# Altium project CSC.PrjPcb
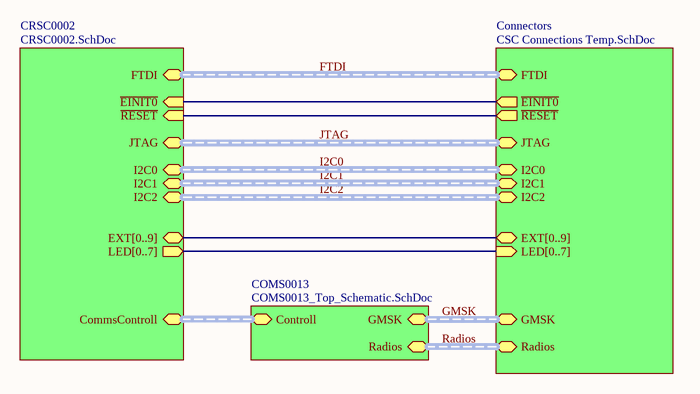
[diagram p0: CRSC0001.SchDoc]
4 sheets, 94 parts. Net scope: hierarchical (ports join the sheet entries above them; power ports are global).
Board file: CSC v2.PcbDoc
Sheets:
  CRSC0001.SchDoc
    CRSC0002 = CRSC0002.SchDoc
    Connectors = CSC Connections Temp.SchDoc
  COMS0004 SwC_Main.SchDoc

## Sheet CRSC0001.SchDoc
size A4

### Sub-sheets
COMS0013 = COMS0013_Top_Schematic.SchDoc (file not in this document): GMSK (harness GMSK), Radios (harness Radios), Controll (harness CommsControll)
Connectors = CSC Connections Temp.SchDoc: JTAG (harness JTAG), FTDI (harness FTDI), I2C0 (harness I2C), I2C1 (harness I2C), I2C2 (harness I2C), GMSK (harness GMSK), Radios (harness Radios), EXT[0..9] (bidir), LED[0..7] (in), ~{EINIT0} (out), ~{RESET} (out)
CRSC0002 = CRSC0002.SchDoc: ~{EINIT0} (in), ~{RESET} (in), I2C1 (harness I2C), I2C0 (harness I2C), I2C2 (harness I2C), JTAG (harness JTAG), CommsControll (harness CommsControll), FTDI (harness FTDI), EXT[0..9] (bidir), LED[0..7] (out)

### Nets
~{RESET}: sheet CRSC0002/~{RESET}, sheet Connectors/~{RESET}
NetS1_3: sheet CRSC0002/~{EINIT0}, sheet Connectors/~{EINIT0}

### Buses and harness runs
bus sheet Connectors/EXT[0..9] = sheet CRSC0002/EXT[0..9]
bus sheet Connectors/LED[0..7] = sheet CRSC0002/LED[0..7]
harness FTDI = sheet Connectors/FTDI = sheet CRSC0002/FTDI
harness GMSK = sheet COMS0013/GMSK = sheet Connectors/GMSK
harness I2C0 = sheet Connectors/I2C0 = sheet CRSC0002/I2C0
harness I2C1 = sheet Connectors/I2C1 = sheet CRSC0002/I2C1
harness I2C2 = sheet Connectors/I2C2 = sheet CRSC0002/I2C2
harness JTAG = sheet Connectors/JTAG = sheet CRSC0002/JTAG
harness Radios = sheet COMS0013/Radios = sheet Connectors/Radios
harness sheet COMS0013/Controll = sheet CRSC0002/CommsControll

## Sheet CRSC0002.SchDoc
size A3; PageSetup: Record=PageOptions|CenterHorizontal=True|CenterVertical=True|PrintScale=0.73|XCorrection=1.00|YCorrection=1.00|PrintKind=1|BorderSize=5000000|LeftOffset=0|BottomOffset=0|Orientation=2|PaperLength=2970|PaperWidth=2100|Scale=100|PaperSource=15|PrintQuality=1200|MediaType=1|DitherType=10|PaperKind=A4|PrintScaleMode=1
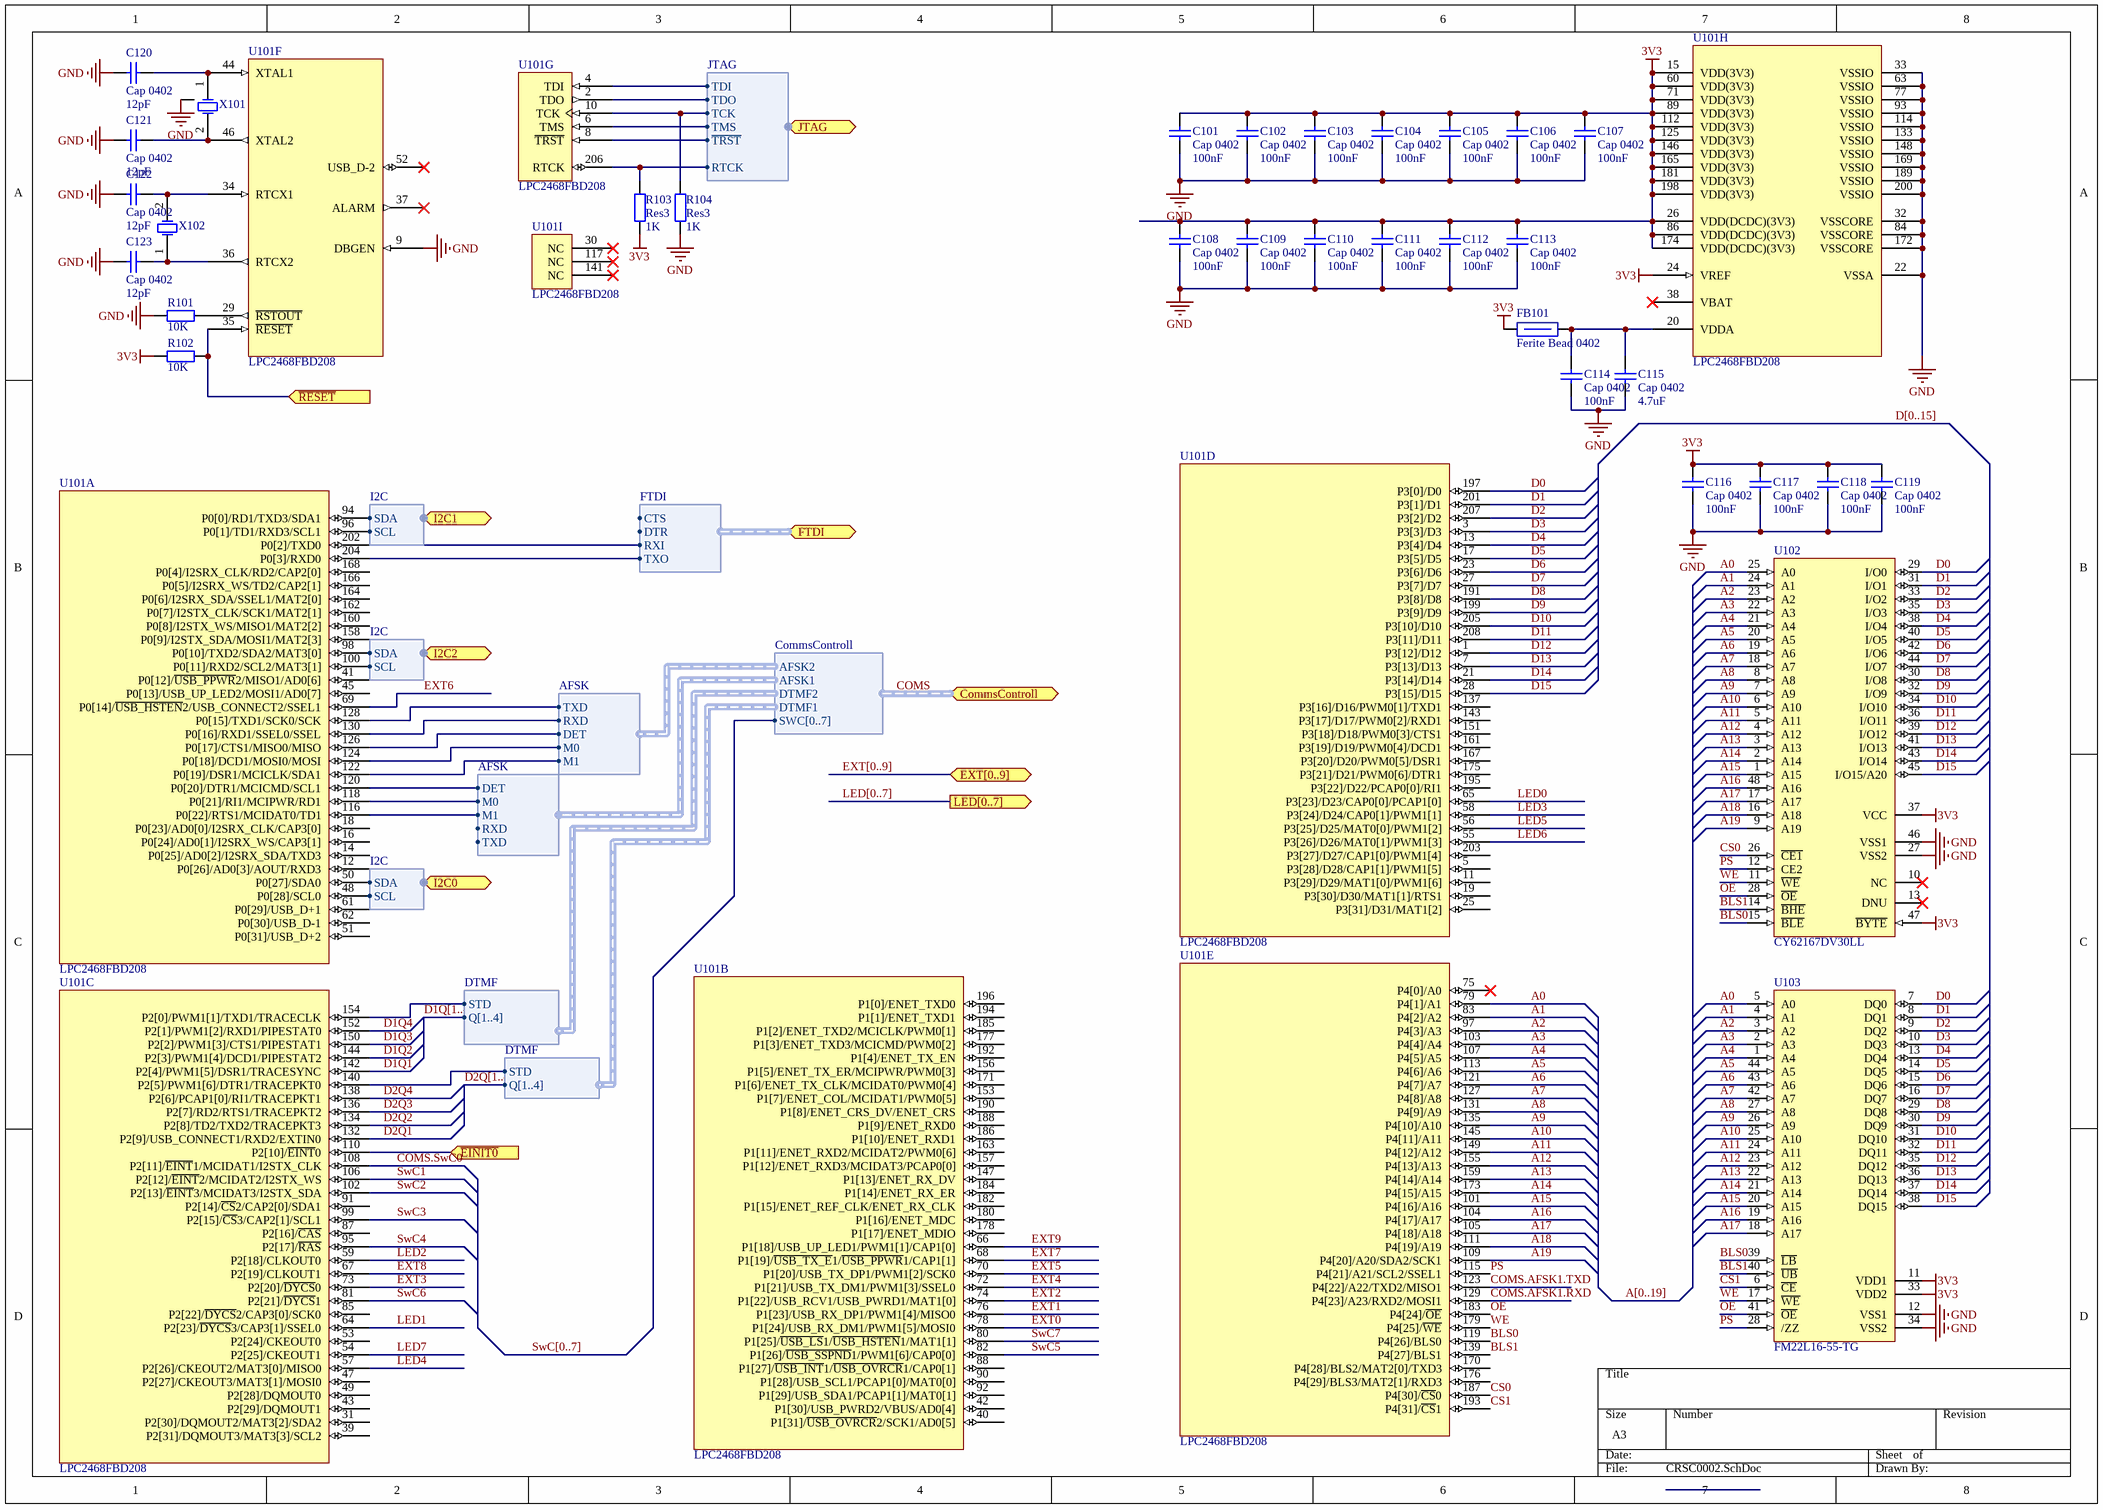
[diagram p1: CRSC0002.SchDoc]

### Parts
C101  Cap 0402  value 100nF  [CAPC1005X06L]
C102  Cap 0402  value 100nF  [CAPC1005X06L]
C103  Cap 0402  value 100nF  [CAPC1005X06L]
C104  Cap 0402  value 100nF  [CAPC1005X06L]
C105  Cap 0402  value 100nF  [CAPC1005X06L]
C106  Cap 0402  value 100nF  [CAPC1005X06L]
C107  Cap 0402  value 100nF  [CAPC1005X06L]
C108  Cap 0402  value 100nF  [CAPC1005X06L]
C109  Cap 0402  value 100nF  [CAPC1005X06L]
C110  Cap 0402  value 100nF  [CAPC1005X06L]
C111  Cap 0402  value 100nF  [CAPC1005X06L]
C112  Cap 0402  value 100nF  [CAPC1005X06L]
C113  Cap 0402  value 100nF  [CAPC1005X06L]
C114  Cap 0402  value 100nF  [CAPC1005X06L]
C115  Cap 0402  value 4.7uF  [CAPC1005X06L]
C116  Cap 0402  value 100nF  [CAPC1005X06L]
C117  Cap 0402  value 100nF  [CAPC1005X06L]
C118  Cap 0402  value 100nF  [CAPC1005X06L]
C119  Cap 0402  value 100nF  [CAPC1005X06L]
C120  Cap 0402  value 12pF  [CAPC1005X06L]
C121  Cap 0402  value 12pF  [CAPC1005X06L]
C122  Cap 0402  value 12pF  [CAPC1005X06L]
C123  Cap 0402  value 12pF  [CAPC1005X06L]
FB101  Ferite Bead 0402  [INDC1005X06L]
R101  value 10K  [RESC1005X06L]  (hidden comment: Res3)
R102  value 10K  [RESC1005X06L]  (hidden comment: Res3)
R103  Res3  value 1K  [RESC1005X06L]
R104  Res3  value 1K  [RESC1005X06L]
U101  LPC2468FBD208  [TSQFP50P3000X3000X160-208L]  (parts A,B,C,D,E,F,G,H,I of 9)
U102  CY62167DV30LL  [TSSOP50P2000X120-48L]
U103  FM22L16-55-TG  [TSOP80P1180X120-44L]
X101  Crystal Oscilator  [7M]  (value not drawn)
X102  Crystal Oscilator  [9H T10]  (value not drawn)

### Ports
CommsControll (harness CommsControll), EXT[0..9] (bidir), FTDI (harness FTDI), I2C0 (harness I2C), I2C1 (harness I2C), I2C2 (harness I2C), JTAG (harness JTAG), LED[0..7] (out), ~{EINIT0} (in), ~{RESET} (in)

### Harnesses
I2C: SDA, SCL
JTAG: TDI, TDO, TCK, TMS, ~{TRST}, RTCK
AFSK: DET, M0, M1, RXD, TXD
DTMF: Q[1..4], STD
CommsControll: AFSK1, AFSK2, DTMF1, DTMF2, SWC[0..7]
FTDI: CTS, DTR, RXI, TXO

### Nets
3V3: C101.2 C102.2 C103.2 C104.2 C105.2 C106.2 C107.2 C108.2 C109.2 C110.2 C111.2 C112.2 C113.2 C116.2 C117.2 C118.2 C119.2 FB101.1 R102.2 R103.2 U101.15(VDD(3V3)) U101.24(VREF) U101.26(VDD(DCDC)(3V3)) U101.60(VDD(3V3)) U101.71(VDD(3V3)) U101.86(VDD(DCDC)(3V3)) U101.89(VDD(3V3)) U101.112(VDD(3V3)) U101.125(VDD(3V3)) U101.146(VDD(3V3)) U101.165(VDD(3V3)) U101.174(VDD(DCDC)(3V3)) U101.181(VDD(3V3)) U101.198(VDD(3V3)) U102.37(VCC) U102.47(~{BYTE}) U103.11(VDD1) U103.33(VDD2)
GND: C101.1 C102.1 C103.1 C104.1 C105.1 C106.1 C107.1 C108.1 C109.1 C110.1 C111.1 C112.1 C113.1 C114.1 C115.1 C116.1 C117.1 C118.1 C119.1 C120.2 C121.1 C122.2 C123.1 R101.2 R104.2 U101.9(DBGEN) U101.22(VSSA) U101.32(VSSCORE) U101.33(VSSIO) U101.63(VSSIO) U101.77(VSSIO) U101.84(VSSCORE) U101.93(VSSIO) U101.114(VSSIO) U101.133(VSSIO) U101.148(VSSIO) U101.169(VSSIO) U101.172(VSSCORE) U101.189(VSSIO) U101.200(VSSIO) U102.27(VSS2) U102.46(VSS1) U103.12(VSS1) U103.34(VSS2) X101.3
A0: U101.79(P4[1]/A1) U102.25(A0) U103.5(A0)
A1: U101.83(P4[2]/A2) U102.24(A1) U103.4(A1)
A2: U101.97(P4[3]/A3) U102.23(A2) U103.3(A2)
A3: U101.103(P4[4]/A4) U102.22(A3) U103.2(A3)
A4: U101.107(P4[5]/A5) U102.21(A4) U103.1(A4)
A5: U101.113(P4[6]/A6) U102.20(A5) U103.44(A5)
A6: U101.121(P4[7]/A7) U102.19(A6) U103.43(A6)
A7: U101.127(P4[8]/A8) U102.18(A7) U103.42(A7)
A8: U101.131(P4[9]/A9) U102.8(A8) U103.27(A8)
A9: U101.135(P4[10]/A10) U102.7(A9) U103.26(A9)
A10: U101.145(P4[11]/A11) U102.6(A10) U103.25(A10)
A11: U101.149(P4[12]/A12) U102.5(A11) U103.24(A11)
A12: U101.155(P4[13]/A13) U102.4(A12) U103.23(A12)
A13: U101.159(P4[14]/A14) U102.3(A13) U103.22(A13)
A14: U101.173(P4[15]/A15) U102.2(A14) U103.21(A14)
A15: U101.101(P4[16]/A16) U102.1(A15) U103.20(A15)
A16: U101.104(P4[17]/A17) U102.48(A16) U103.19(A16)
A17: U101.105(P4[18]/A18) U102.17(A17) U103.18(A17)
A18: U101.111(P4[19]/A19) U102.16(A18)
A19: U101.109(P4[20]/A20/SDA2/SCK1) U102.9(A19)
BLS0: U101.119(P4[26]/BLS0) U102.15(~{BLE}) U103.39(~{LB})
BLS1: U101.139(P4[27]/BLS1) U102.14(~{BHE}) U103.40(~{UB})
COMS.AFSK1.RXD: U101.129(P4[23]/A23/RXD2/MOSI1)
COMS.AFSK1.TXD: U101.123(P4[22]/A22/TXD2/MISO1)
COMS.SwC0: U101.108(P2[11]/~{EINT}1/MCIDAT1/I2STX_CLK)
CS0: U101.187(P4[30]/~{CS}0) U102.26(~{CE1})
CS1: U101.193(P4[31]/~{CS}1) U103.6(~{CE})
D0: U101.197(P3[0]/D0) U102.29(I/O0) U103.7(DQ0)
D1: U101.201(P3[1]/D1) U102.31(I/O1) U103.8(DQ1)
D1Q1: U101.142(P2[4]/PWM1[5]/DSR1/TRACESYNC)
D1Q2: U101.144(P2[3]/PWM1[4]/DCD1/PIPESTAT2)
D1Q3: U101.150(P2[2]/PWM1[3]/CTS1/PIPESTAT1)
D1Q4: U101.152(P2[1]/PWM1[2]/RXD1/PIPESTAT0)
D2: U101.207(P3[2]/D2) U102.33(I/O2) U103.9(DQ2)
D2Q1: U101.132(P2[9]/USB_CONNECT1/RXD2/EXTIN0)
D2Q2: U101.134(P2[8]/TD2/TXD2/TRACEPKT3)
D2Q3: U101.136(P2[7]/RD2/RTS1/TRACEPKT2)
D2Q4: U101.138(P2[6]/PCAP1[0]/RI1/TRACEPKT1)
D3: U101.3(P3[3]/D3) U102.35(I/O3) U103.10(DQ3)
D4: U101.13(P3[4]/D4) U102.38(I/O4) U103.13(DQ4)
D5: U101.17(P3[5]/D5) U102.40(I/O5) U103.14(DQ5)
D6: U101.23(P3[6]/D6) U102.42(I/O6) U103.15(DQ6)
D7: U101.27(P3[7]/D7) U102.44(I/O7) U103.16(DQ7)
D8: U101.191(P3[8]/D8) U102.30(I/O8) U103.29(DQ8)
D9: U101.199(P3[9]/D9) U102.32(I/O9) U103.30(DQ9)
D10: U101.205(P3[10]/D10) U102.34(I/O10) U103.31(DQ10)
D11: U101.208(P3[11]/D11) U102.36(I/O11) U103.32(DQ11)
D12: U101.1(P3[12]/D12) U102.39(I/O12) U103.35(DQ12)
D13: U101.7(P3[13]/D13) U102.41(I/O13) U103.36(DQ13)
D14: U101.21(P3[14]/D14) U102.43(I/O14) U103.37(DQ14)
D15: U101.28(P3[15]/D15) U102.45(I/O15/A20) U103.38(DQ15)
EXT0: U101.78(P1[24]/USB_RX_DM1/PWM1[5]/MOSI0)
EXT1: U101.76(P1[23]/USB_RX_DP1/PWM1[4]/MISO0)
EXT2: U101.74(P1[22]/USB_RCV1/USB_PWRD1/MAT1[0])
EXT3: U101.73(P2[20]/~{DYCS}0)
EXT4: U101.72(P1[21]/USB_TX_DM1/PWM1[3]/SSEL0)
EXT5: U101.70(P1[20]/USB_TX_DP1/PWM1[2]/SCK0)
EXT6: U101.69(P0[14]/~{USB_HSTEN}2/USB_CONNECT2/SSEL1)
EXT7: U101.68(P1[19]/~{USB_TX_E}1/~{USB_PPWR}1/CAP1[1])
EXT8: U101.67(P2[19]/CLKOUT1)
EXT9: U101.66(P1[18]/USB_UP_LED1/PWM1[1]/CAP1[0])
FTDI.RXI: U101.202(P0[2]/TXD0) ; port FTDI.RXI
FTDI.TXO: U101.204(P0[3]/RXD0) ; port FTDI.TXO
I2C0.SCL: U101.48(P0[28]/SCL0) ; port I2C0.SCL
I2C0.SDA: U101.50(P0[27]/SDA0) ; port I2C0.SDA
I2C1.SCL: U101.96(P0[1]/TD1/RXD3/SCL1) ; port I2C1.SCL
I2C1.SDA: U101.94(P0[0]/RD1/TXD3/SDA1) ; port I2C1.SDA
I2C2.SCL: U101.100(P0[11]/RXD2/SCL2/MAT3[1]) ; port I2C2.SCL
I2C2.SDA: U101.98(P0[10]/TXD2/SDA2/MAT3[0]) ; port I2C2.SDA
JTAG.RTCK: R103.1 U101.206(RTCK) ; port JTAG.RTCK
JTAG.~{TRST}: U101.8(~{TRST}) ; port JTAG.~{TRST}
JTAG.TCK: R104.1 U101.10(TCK) ; port JTAG.TCK
JTAG.TDI: U101.4(TDI) ; port JTAG.TDI
JTAG.TDO: U101.2(TDO) ; port JTAG.TDO
JTAG.TMS: U101.6(TMS) ; port JTAG.TMS
LED0: U101.65(P3[23]/D23/CAP0[0]/PCAP1[0])
LED1: U101.64(P2[23]/~{DYCS}3/CAP3[1]/SSEL0)
LED2: U101.59(P2[18]/CLKOUT0)
LED3: U101.58(P3[24]/D24/CAP0[1]/PWM1[1])
LED4: U101.57(P2[26]/CKEOUT2/MAT3[0]/MISO0)
LED5: U101.56(P3[25]/D25/MAT0[0]/PWM1[2])
LED6: U101.55(P3[26]/D26/MAT0[1]/PWM1[3])
LED7: U101.54(P2[25]/CKEOUT1)
OE: U101.183(P4[24]/~{OE}) U102.28(~{OE}) U103.41(~{OE})
PS: U101.115(P4[21]/A21/SCL2/SSEL1) U102.12(CE2) U103.28(/ZZ)
~{RESET}: R102.1 U101.35(~{RESET}) ; port ~{RESET}
SwC1: U101.106(P2[12]/~{EINT}2/MCIDAT2/I2STX_WS)
SwC2: U101.102(P2[13]/~{EINT}3/MCIDAT3/I2STX_SDA)
SwC3: U101.99(P2[15]/~{CS}3/CAP2[1]/SCL1)
SwC4: U101.95(P2[17]/~{RAS})
SwC5: U101.82(P1[26]/~{USB_SSPND}1/PWM1[6]/CAP0[0])
SwC6: U101.81(P2[21]/~{DYCS}1)
SwC7: U101.80(P1[25]/~{USB_LS}1/~{USB_HSTEN}1/MAT1[1])
WE: U101.179(P4[25]/~{WE}) U102.11(~{WE}) U103.17(~{WE})
NetC114_2: C114.2 C115.2 FB101.2 U101.20(VDDA)
NetC120_1: C120.1 U101.44(XTAL1) X101.1(OSC1)
NetC121_2: C121.2 U101.46(XTAL2) X101.2(OSC2)
NetC122_1: C122.1 U101.34(RTCX1) X102.2(OSC2)
NetC123_2: C123.2 U101.36(RTCX2) X102.1(OSC1)
NetR101_1: R101.1 U101.29(~{RSTOUT})
NetS1_3: U101.110(P2[10]/~{EINT}0) ; port ~{EINIT0}
NetU101_116: U101.116(P0[22]/RTS1/MCIDAT0/TD1) ; harness AFSK.M1
NetU101_118: U101.118(P0[21]/RI1/MCIPWR/RD1) ; harness AFSK.M0
NetU101_120: U101.120(P0[20]/DTR1/MCICMD/SCL1) ; harness AFSK.DET
NetU101_122: U101.122(P0[19]/DSR1/MCICLK/SDA1) ; harness AFSK.M1
NetU101_124: U101.124(P0[18]/DCD1/MOSI0/MOSI) ; harness AFSK.M0
NetU101_126: U101.126(P0[17]/CTS1/MISO0/MISO) ; harness AFSK.DET
NetU101_128: U101.128(P0[15]/TXD1/SCK0/SCK) ; harness AFSK.TXD
NetU101_130: U101.130(P0[16]/RXD1/SSEL0/SSEL) ; harness AFSK.RXD
NetU101_140: U101.140(P2[5]/PWM1[6]/DTR1/TRACEPKT0) ; harness DTMF.STD
NetU101_154: U101.154(P2[0]/PWM1[1]/TXD1/TRACECLK) ; harness DTMF.STD

Not connected (* = marked no-connect by the designer): U101 5(P3[28]/D28/CAP1[1]/PWM1[5]) 11(P3[29]/D29/MAT1[0]/PWM1[6]) 12(P0[26]/AD0[3]/AOUT/RXD3) 14(P0[25]/AD0[2]/I2SRX_SDA/TXD3) 16(P0[24]/AD0[1]/I2SRX_WS/CAP3[1]) 18(P0[23]/AD0[0]/I2SRX_CLK/CAP3[0]) 19(P3[30]/D30/MAT1[1]/RTS1) 25(P3[31]/D31/MAT1[2]) 30(NC)* 31(P2[30]/DQMOUT2/MAT3[2]/SDA2) 37(ALARM)* 38(VBAT)* 39(P2[31]/DQMOUT3/MAT3[3]/SCL2) 40(P1[31]/~{USB_OVRCR}2/SCK1/AD0[5]) 41(P0[12]/~{USB_PPWR}2/MISO1/AD0[6]) 42(P1[30]/USB_PWRD2/VBUS/AD0[4]) 43(P2[29]/DQMOUT1) 45(P0[13]/USB_UP_LED2/MOSI1/AD0[7]) 47(P2[27]/CKEOUT3/MAT3[1]/MOSI0) 49(P2[28]/DQMOUT0) 51(P0[31]/USB_D+2) 52(USB_D-2)* 53(P2[24]/CKEOUT0) 61(P0[29]/USB_D+1) 62(P0[30]/USB_D-1) 75(P4[0]/A0)* 85(P2[22]/~{DYCS}2/CAP3[0]/SCK0) 87(P2[16]/~{CAS}) 88(P1[27]/~{USB_INT}1/~{USB_OVRCR}1/CAP0[1]) 90(P1[28]/USB_SCL1/PCAP1[0]/MAT0[0]) 91(P2[14]/~{CS}2/CAP2[0]/SDA1) 92(P1[29]/USB_SDA1/PCAP1[1]/MAT0[1]) 117(NC)* 137(P3[16]/D16/PWM0[1]/TXD1) 141(NC)* 143(P3[17]/D17/PWM0[2]/RXD1) 147(P1[13]/ENET_RX_DV) 151(P3[18]/D18/PWM0[3]/CTS1) 153(P1[7]/ENET_COL/MCIDAT1/PWM0[5]) 156(P1[5]/ENET_TX_ER/MCIPWR/PWM0[3]) 157(P1[12]/ENET_RXD3/MCIDAT3/PCAP0[0]) 158(P0[9]/I2STX_SDA/MOSI1/MAT2[3]) 160(P0[8]/I2STX_WS/MISO1/MAT2[2]) 161(P3[19]/D19/PWM0[4]/DCD1) 162(P0[7]/I2STX_CLK/SCK1/MAT2[1]) 163(P1[11]/ENET_RXD2/MCIDAT2/PWM0[6]) 164(P0[6]/I2SRX_SDA/SSEL1/MAT2[0]) 166(P0[5]/I2SRX_WS/TD2/CAP2[1]) 167(P3[20]/D20/PWM0[5]/DSR1) 168(P0[4]/I2SRX_CLK/RD2/CAP2[0]) 170(P4[28]/BLS2/MAT2[0]/TXD3) 171(P1[6]/ENET_TX_CLK/MCIDAT0/PWM0[4]) 175(P3[21]/D21/PWM0[6]/DTR1) 176(P4[29]/BLS3/MAT2[1]/RXD3) 177(P1[3]/ENET_TXD3/MCICMD/PWM0[2]) 178(P1[17]/ENET_MDIO) 180(P1[16]/ENET_MDC) 182(P1[15]/ENET_REF_CLK/ENET_RX_CLK) 184(P1[14]/ENET_RX_ER) 185(P1[2]/ENET_TXD2/MCICLK/PWM0[1]) 186(P1[10]/ENET_RXD1) 188(P1[9]/ENET_RXD0) 190(P1[8]/ENET_CRS_DV/ENET_CRS) 192(P1[4]/ENET_TX_EN) 194(P1[1]/ENET_TXD1) 195(P3[22]/D22/PCAP0[0]/RI1) 196(P1[0]/ENET_TXD0) 203(P3[27]/D27/CAP1[0]/PWM1[4]); U102 10(NC)* 13(DNU)*

### Buses and harness runs
bus A[0..19]
bus D1Q[1..4]
bus D2Q[1..4]
bus D[0..15]
bus EXT[0..9] = port EXT[0..9]
bus LED[0..7] = port LED[0..7]
bus SwC[0..7]
harness COMS = port CommsControll

### Library data of the parts
C101-C123 = Cap 0402: Capacitor; Published: 8-Jun-2000; LatestRevisionDate: 17-Jul-2002; LatestRevisionNote: Re-released for DXP Platform.; PackageReference: RAD-0.3; Publisher: Altium Limited; PackageDescription: Radial Cap, Thru-Hole; 2 Leads; 0.3 in Pin Spacing
FB101 = FB_0402: Ferite Bead : 0402; Published: 8-Jun-2000; LatestRevisionDate: 29-May-2009; LatestRevisionNote: IPC-7351 Footprint Added.; PackageReference: J1-0603; Publisher: Altium Limited; PackageDescription: Chip Resistor
R101-R104 = Res3: Resistor; Published: 8-Jun-2000; LatestRevisionDate: 29-May-2009; LatestRevisionNote: IPC-7351 Footprint Added.; PackageReference: J1-0603; Publisher: Altium Limited; PackageDescription: Chip Resistor
U101 = LPC2468FBD208: ARM7 16/32-Bit Microcontroller, 512KB Flash, 98KB RAM, 208-Lead LQFP; Code_IEC: 136E30; Published: 17-Aug-2007; DatasheetVersion: rev.01, Jul-2007; PackageVersion: Feb-2003; PackageReference: SOT459-1; Publisher: Altium Limited; PackageDescription: 208-Pin Plastic Low Profile Quad Flat Pack, LQFP208; Code_JEDEC: MS-026; ComponentLink1Description: Manufacturer Link; ComponentLink1URL: http://www.nxp.com/; ComponentLink2Description: Datasheet; ComponentLink2URL: http://www.standardics.nxp.com/products/lpc2000/datasheet/lpc2468.pdf
U102 = CY62167DV30LL: 16-Mbit (1M x 16) Static RAM; ColumnAddress: A0-A9; Publisher: Altium Limited; ComponentLink1Description: Manufacturer Link; ComponentLink2Description: Datasheet
U103 = FM22L16-55-TG: FRAM, 2MB, 3V, 60NS, 44TSOP2; ColumnAddress: A0-A9; LatestRevisionDate: 13-Apr-2006; DatasheetVersion: rev1.1, Feb-2004; PackageReference: TSOP2-44_M; PackageDescription: 44-Pin Small Outline Package 0.8 mm Pitch; ComponentLink1Description: Manufacturer Link; ComponentLink2Description: Datasheet
X101 = C.O. 4pins: Crystal Oscillator; Value: 12.000MHz; Published: 8-Jun-2000; LatestRevisionDate: 17-Jul-2002; LatestRevisionNote: Re-released for DXP Platform.; PackageReference: R38; Publisher: Altium Limited
X102 = C.O. 2pins: Crystal Oscillator; Value: 12.000MHz; Published: 8-Jun-2000; LatestRevisionDate: 17-Jul-2002; LatestRevisionNote: Re-released for DXP Platform.; PackageReference: R38; Publisher: Altium Limited

## Sheet CSC Connections Temp.SchDoc
size A4
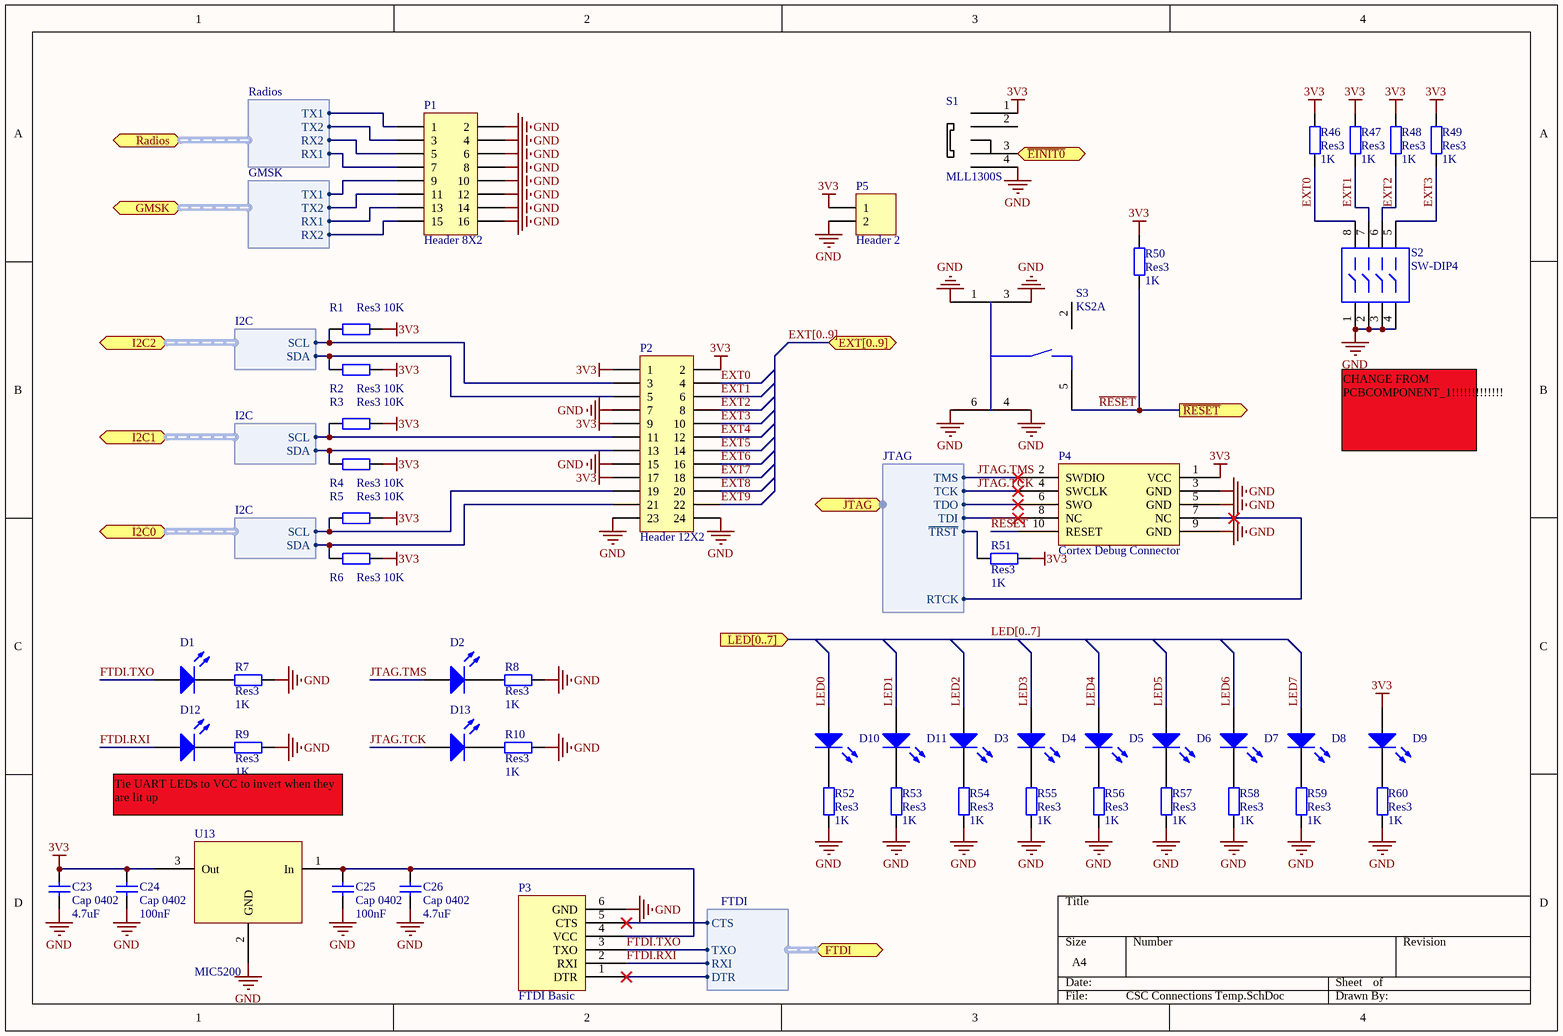
[diagram p2: CSC Connections Temp.SchDoc]

### Parts
C23  Cap 0402  value 4.7uF  [CAPC1005X06L]
C24  Cap 0402  value 100nF  [CAPC1005X06L]
C25  Cap 0402  value 100nF  [CAPC1005X06L]
C26  Cap 0402  value 4.7uF  [CAPC1005X06L]
D1  LED - ASMT-Rx45  [ASMT-Rx45]  (value not drawn)
D2  LED - ASMT-Rx45  [ASMT-Rx45]  (value not drawn)
D3  LED - ASMT-Rx45  [ASMT-Rx45]  (value not drawn)
D4  LED - ASMT-Rx45  [ASMT-Rx45]  (value not drawn)
D5  LED - ASMT-Rx45  [ASMT-Rx45]  (value not drawn)
D6  LED - ASMT-Rx45  [ASMT-Rx45]  (value not drawn)
D7  LED - ASMT-Rx45  [ASMT-Rx45]  (value not drawn)
D8  LED - ASMT-Rx45  [ASMT-Rx45]  (value not drawn)
D9  LED - ASMT-Rx45  [ASMT-Rx45]  (value not drawn)
D10  LED - ASMT-Rx45  [ASMT-Rx45]  (value not drawn)
D11  LED - ASMT-Rx45  [ASMT-Rx45]  (value not drawn)
D12  LED - ASMT-Rx45  [ASMT-Rx45]  (value not drawn)
D13  LED - ASMT-Rx45  [ASMT-Rx45]  (value not drawn)
P1  Header 8X2  [HDR2X8]
P2  Header 12X2  [HDR2X12]
P3  FTDI Basic  [FTDI BASIC]
P4  Cortex Debug Connector  [FTSH-105-01-L-DV-TR]
P5  Header 2  [HDR1X2]
R1  Res3  value 10K  [RESC1005X06L]
R2  Res3  value 10K  [RESC1005X06L]
R3  Res3  value 10K  [RESC1005X06L]
R4  Res3  value 10K  [RESC1005X06L]
R5  Res3  value 10K  [RESC1005X06L]
R6  Res3  value 10K  [RESC1005X06L]
R7  Res3  value 1K  [RESC1005X06L]
R8  Res3  value 1K  [RESC1005X06L]
R9  Res3  value 1K  [RESC1005X06L]
R10  Res3  value 1K  [RESC1005X06L]
R46  Res3  value 1K  [RESC1005X06L]
R47  Res3  value 1K  [RESC1005X06L]
R48  Res3  value 1K  [RESC1005X06L]
R49  Res3  value 1K  [RESC1005X06L]
R50  Res3  value 1K  [RESC1005X06L]
R51  Res3  value 1K  [RESC1005X06L]
R52  Res3  value 1K  [RESC1005X06L]
R53  Res3  value 1K  [RESC1005X06L]
R54  Res3  value 1K  [RESC1005X06L]
R55  Res3  value 1K  [RESC1005X06L]
R56  Res3  value 1K  [RESC1005X06L]
R57  Res3  value 1K  [RESC1005X06L]
R58  Res3  value 1K  [RESC1005X06L]
R59  Res3  value 1K  [RESC1005X06L]
R60  Res3  value 1K  [RESC1005X06L]
S1  MLL1300S  [MILL1300S]
S2  SW-DIP4  [PCBComponent_1]
S3  KS2A  [K5A2]
U13  MIC5200  [SOT230P710X170-4L]

### Ports
EXT[0..9] (bidir), FTDI (harness FTDI), GMSK (harness GMSK), I2C0 (harness I2C), I2C1 (harness I2C), I2C2 (harness I2C), JTAG (harness JTAG), LED[0..7] (in), Radios (harness Radios), ~{EINIT0} (out), ~{RESET} (out)

### Harnesses
JTAG: RTCK, ~{TRST}, TCK, TDI, TDO, TMS
FTDI: DTR, RXI, TXO, CTS
I2C: SCL, SDA
GMSK: RX1, RX2, TX1, TX2
Radios: RX1, RX2, TX1, TX2

### Nets
3V3: C23.2 C24.2 D9.1(A) P2.1 P2.2 P2.9 P2.17 P4.1(VCC) P5.1 R1.2 R2.2 R3.2 R4.2 R5.2 R6.2 R46.1 R47.1 R48.1 R49.1 R50.1 R51.2 S1.1 U13.3(Out)
GND: C23.1 C24.1 C25.1 C26.1 P1.2 P1.4 P1.6 P1.8 P1.10 P1.12 P1.14 P1.16 P2.7 P2.15 P2.23 P2.24 P3.6(GND) P4.3(GND) P4.5(GND) P4.9(GND) P5.2 R7.2 R8.2 R9.2 R10.2 R52.2 R53.2 R54.2 R55.2 R56.2 R57.2 R58.2 R59.2 R60.2 S1.4 S2.1 S2.2 S2.3 S2.4 S3.1 S3.3 S3.4 S3.6 U13.2(GND)
EXT0: P2.4 R46.2 S2.8
EXT1: P2.6 R47.2 S2.7
EXT2: P2.8 R48.2 S2.6
EXT3: P2.10 R49.2 S2.5
EXT4: P2.12
EXT5: P2.14
EXT6: P2.16
EXT7: P2.18
EXT8: P2.20
EXT9: P2.22
FTDI.CTS: P3.5(CTS) ; port FTDI.CTS
FTDI.DTR: P3.1(DTR) ; port FTDI.DTR
FTDI.RXI: D12.1(A) P3.2(RXI) ; port FTDI.RXI
FTDI.TXO: D1.1(A) P3.3(TXO) ; port FTDI.TXO
GMSK.RX1: P1.13 ; port GMSK.RX1
GMSK.RX2: P1.15 ; port GMSK.RX2
GMSK.TX1: P1.9 ; port GMSK.TX1
GMSK.TX2: P1.11 ; port GMSK.TX2
I2C0.SCL: P2.19 R5.1 ; port I2C0.SCL
I2C0.SDA: P2.21 R6.1 ; port I2C0.SDA
I2C1.SCL: P2.11 R3.1 ; port I2C1.SCL
I2C1.SDA: P2.13 R4.1 ; port I2C1.SDA
I2C2.SCL: P2.3 R1.1 ; port I2C2.SCL
I2C2.SDA: P2.5 R2.1 ; port I2C2.SDA
JTAG.RTCK: P4.7(NC) ; port JTAG.RTCK
JTAG.~{TRST}: R51.1 ; port JTAG.~{TRST}
JTAG.TCK: D13.1(A) P4.4(SWCLK) ; port JTAG.TCK
JTAG.TDI: P4.8(NC) ; port JTAG.TDI
JTAG.TDO: P4.6(SWO) ; port JTAG.TDO
JTAG.TMS: D2.1(A) P4.2(SWDIO) ; port JTAG.TMS
LED0: D10.1(A)
LED1: D11.1(A)
LED2: D3.1(A)
LED3: D4.1(A)
LED4: D5.1(A)
LED5: D6.1(A)
LED6: D7.1(A)
LED7: D8.1(A)
~{RESET}: P4.10(RESET) R50.2 S3.5 ; port ~{RESET}
Radios.RX1: P1.7 ; port Radios.RX1
Radios.RX2: P1.5 ; port Radios.RX2
Radios.TX1: P1.1 ; port Radios.TX1
Radios.TX2: P1.3 ; port Radios.TX2
NetC25_2: C25.2 C26.2 P3.4(VCC) U13.1(In)
NetD1_2: D1.2(K) R7.1
NetD2_2: D2.2(K) R8.1
NetD3_2: D3.2(K) R54.1
NetD4_2: D4.2(K) R55.1
NetD5_2: D5.2(K) R56.1
NetD6_2: D6.2(K) R57.1
NetD7_2: D7.2(K) R58.1
NetD8_2: D8.2(K) R59.1
NetD9_2: D9.2(K) R60.1
NetD10_2: D10.2(K) R52.1
NetD11_2: D11.2(K) R53.1
NetD12_2: D12.2(K) R9.1
NetD13_2: D13.2(K) R10.1
NetS1_3: S1.3 ; port ~{EINIT0}

Not connected (* = marked no-connect by the designer): S1 2; S3 2

### Buses and harness runs
bus EXT[0..9] = port EXT[0..9]
bus LED[0..7] = port LED[0..7]

### Notes on the sheet
- CHANGE FROM PCBCOMPONENT_1!!!!!!!!!!!!!
- Tie UART LEDs to VCC to invert when they are lit up

### Library data of the parts
C23-C26 = Cap 0402: Capacitor; Published: 8-Jun-2000; LatestRevisionDate: 17-Jul-2002; LatestRevisionNote: Re-released for DXP Platform.; PackageReference: RAD-0.3; Publisher: Altium Limited; PackageDescription: Radial Cap, Thru-Hole; 2 Leads; 0.3 in Pin Spacing
D1-D13 = LED: Typical INFRARED GaAs LED 0603; Published: 8-Jun-2000; LatestRevisionDate: 08-Jul-2005; LatestRevisionNote: Mech Layer 1 removed.; PackageReference: LED-0; Publisher: Altium Limited; PackageDescription: LED; 2 Leads
P1 = Header 8X2: Header, 8-Pin, Dual row; LatestRevisionDate: 17-Jul-2002; LatestRevisionNote: Re-released for DXP Platform.; Publisher: Altium Limited
P2 = Header 12X2: Header, 12-Pin, Dual row; LatestRevisionDate: 17-Jul-2002; LatestRevisionNote: Re-released for DXP Platform.; Publisher: Altium Limited
P4 = Cortex Debug Connector: Mates with FFSD-05-D-12.00-01-N
P5 = Header 2: Header, 2-Pin; LatestRevisionDate: 17-Jul-2002; LatestRevisionNote: Re-released for DXP Platform.; Publisher: Altium Limited
R1-R10 R46-R60 = Res3: Resistor; Published: 8-Jun-2000; LatestRevisionDate: 29-May-2009; LatestRevisionNote: IPC-7351 Footprint Added.; PackageReference: J1-0603; Publisher: Altium Limited; PackageDescription: Chip Resistor
S1 = MLL1300S: Slide switch SP3T switch
S2 = SW-DIP4: DIP Switch - 1571983-5; Published: 24-Mar-1999; LatestRevisionDate: 17-Jul-2002; LatestRevisionNote: Re-released for DXP Platform.; PackageReference: DIP-8; Publisher: Altium Limited
S3 = KS2A: Tact Switch

## Sheet COMS0004 SwC_Main.SchDoc: BLUEsat Switching Circuit Overview
size A3; Engineer: D. JEDRYCHOWSKI; Organization: BLUEsat Project; Address1: Room 419; Address2: School of EE&T; Address3: UNSW, NSW 2052; Address4: Australia; DocumentNumber: COMS0004; SheetNumber: 1; SheetTotal: 4; Description: Overview of Switching Circuit; Version: 1.0
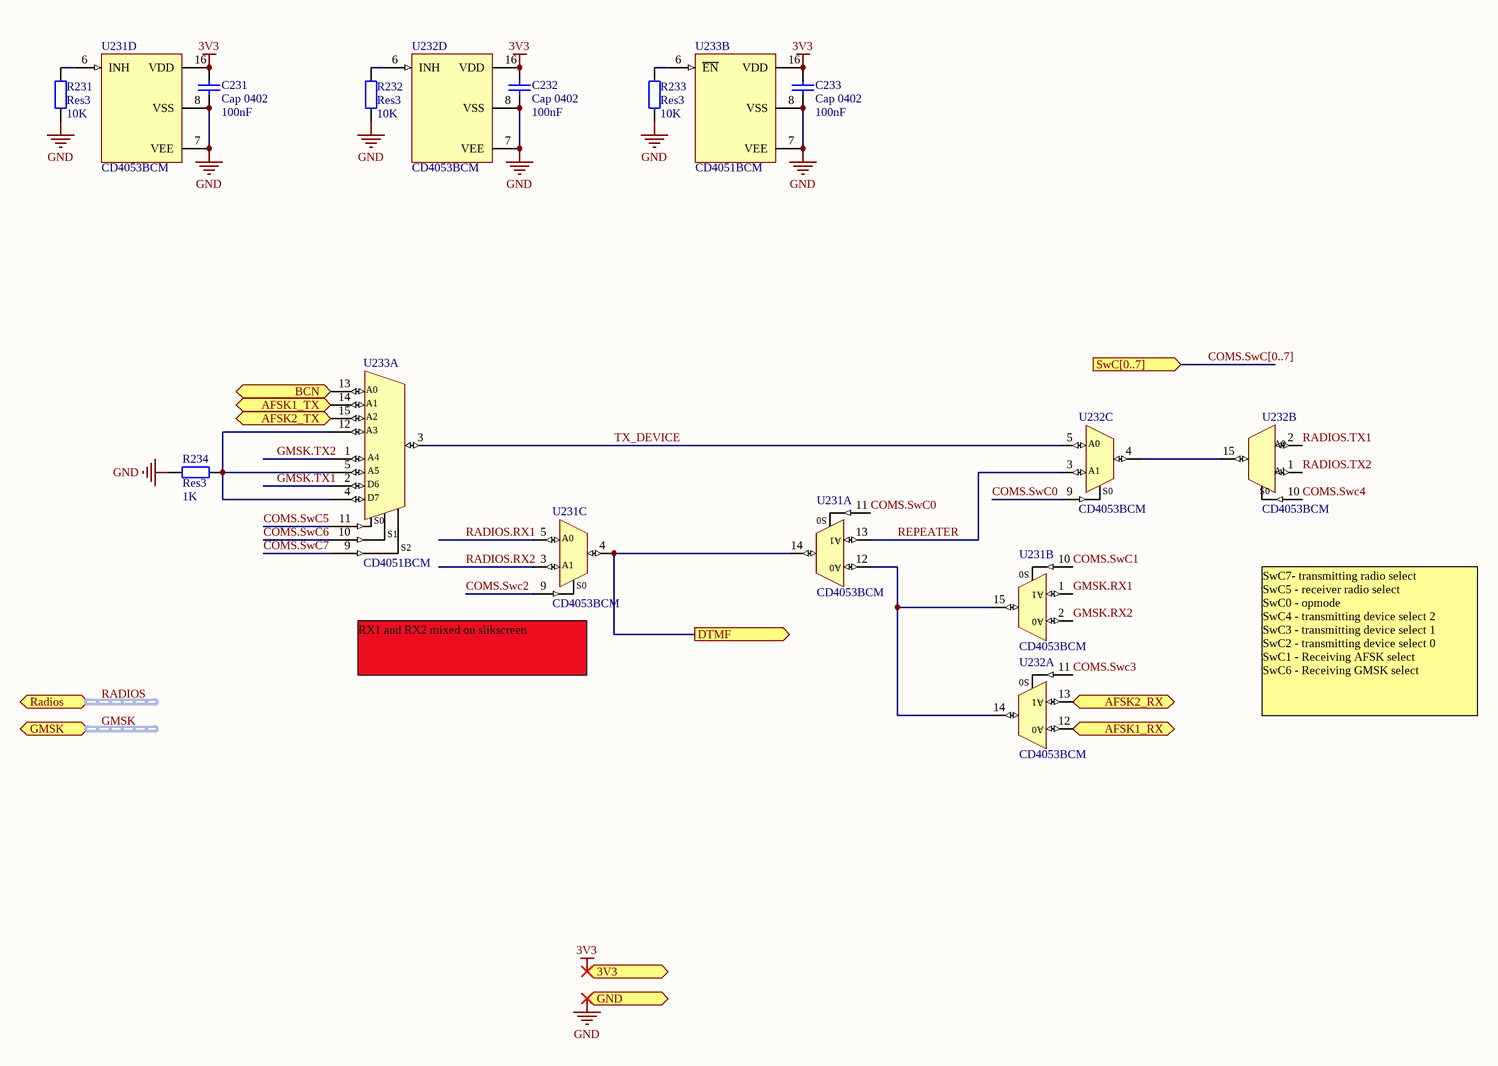
[diagram p3: COMS0004 SwC_Main.SchDoc]

### Parts
C231  Cap 0402  value 100nF  [CAPC1005X06L]
C232  Cap 0402  value 100nF  [CAPC1005X06L]
C233  Cap 0402  value 100nF  [CAPC1005X06L]
R231  Res3  value 10K  [RESC1005X06L]
R232  Res3  value 10K  [RESC1005X06L]
R233  Res3  value 10K  [RESC1005X06L]
R234  Res3  value 1K  [RESC1005X06L]
U231  CD4053BCM  [TSSOP16]  (parts A,B,C,D of 4)
U232  CD4053BCM  [TSSOP16]  (parts A,B,C,D of 4)
U233  CD4051BCM  [TSSOP16]  (parts A,B of 2)

### Ports
3V3 (in), AFSK1_RX (out), AFSK1_TX (in), AFSK2_RX (out), AFSK2_TX (in), BCN (in), DTMF (out), GMSK (harness GMSK), GND (in), Radios (harness RADIOS), SwC[0..7] (in)

### Nets
3V3: C231.2 C232.2 C233.2 U231.16(VDD) U232.16(VDD) U233.16(VDD) ; port 3V3
GND: C231.1 C232.1 C233.1 R231.2 R232.2 R233.2 R234.1 U231.7(VEE) U231.8(VSS) U232.7(VEE) U232.8(VSS) U233.7(VEE) U233.8(VSS) ; port GND
COMS.SwC0: U231.11(A) U232.9(C)
COMS.SwC1: U231.10(B)
COMS.Swc2: U231.9(C)
COMS.Swc3: U232.11(A)
COMS.Swc4: U232.10(B)
COMS.SwC5: U233.11(S0)
COMS.SwC6: U233.10(S1)
COMS.SwC7: U233.9(S2)
GMSK.RX1: U231.1(by)
GMSK.RX2: U231.2(bx)
GMSK.TX1: U233.2(A6)
GMSK.TX2: U233.1(A4)
RADIOS.RX1: U231.5(cx)
RADIOS.RX2: U231.3(cy)
RADIOS.TX1: U232.2(bx)
RADIOS.TX2: U232.1(by)
REPEATER: U231.13(A1) U232.3(cy)
TX_DEVICE: U232.5(cx) U233.3(O)
NetR231_1: R231.1 U231.6(INH)
NetR232_1: R232.1 U232.6(INH)
NetR233_1: R233.1 U233.6(~{EN})
NetR234_2: R234.2 U233.4(A7) U233.5(A5) U233.12(A3)
NetU231_4: U231.4(c_out) U231.14(A_out) ; port DTMF
NetU231_12: U231.12(A0) U231.15(b_out) U232.14(A_out)
NetU232_4: U232.4(c_out) U232.15(b_out)
NetU232_12: U232.12(A0) ; port AFSK1_RX
NetU232_13: U232.13(A1) ; port AFSK2_RX
NetU233_13: U233.13(A0) ; port BCN
NetU233_14: U233.14(A1) ; port AFSK1_TX
NetU233_15: U233.15(A2) ; port AFSK2_TX

### Buses and harness runs
bus COMS.SwC[0..7] = port SwC[0..7]
harness GMSK = port GMSK
harness RADIOS = port Radios

### Notes on the sheet
- (near U231) RX1 and RX2 mixed on slikscreen
- SwC7- transmitting radio select
  SwC5 - receiver radio select
  SwC0 - opmode
  SwC4 - transmitting device select 2
  SwC3 - transmitting device select 1
  SwC2 - transmitting device select 0
  SwC1 - Receiving AFSK select
  SwC6 - Receiving GMSK select
- Title
- Description:
- Size:
- Author:
- Date:
- A3
- Time:
- Version
- Sheet:
- Drawing No.:
- of
- File:
- (in symbol CD4051BCM, part A) D6; D7
- (in symbol CD4053BCM, part A) S0
- (in symbol CD4053BCM, part B) S0
- (in symbol CD4053BCM, part C) S0

### Library data of the parts
C231-C233 = Cap 0402: Capacitor; Published: 8-Jun-2000; LatestRevisionDate: 17-Jul-2002; LatestRevisionNote: Re-released for DXP Platform.; PackageReference: RAD-0.3; Publisher: Altium Limited; PackageDescription: Radial Cap, Thru-Hole; 2 Leads; 0.3 in Pin Spacing
R231-R234 = Res3: Resistor; Published: 8-Jun-2000; LatestRevisionDate: 29-May-2009; LatestRevisionNote: IPC-7351 Footprint Added.; PackageReference: J1-0603; Publisher: Altium Limited; PackageDescription: Chip Resistor
U231 U232 = CD4053BCM: Triple 2-Channnel Analog Multiplexer/Demutiplexer; Supplier 1: Farnell; Supplier Part Number 1: 2132284
U233 = CD4051BCM: 8-Channel Analog Multiplexer/Demultiplexer; Datasheet Link: http://focus.ti.com/lit/ds/symlink/cd4052b.pdf; Supplier 1: Farnell; Supplier Part Number 1: 1753421

## Nets that join several sheets
3V3: CRSC0002 (38 pins), CSC Connections Temp (23 pins), COMS0004 SwC_Main (6 pins)
GND: CRSC0002 (45 pins), CSC Connections Temp (44 pins), COMS0004 SwC_Main (13 pins)
EXT0: CRSC0002 (U101.78), CSC Connections Temp (P2.4 R46.2 S2.8)
EXT1: CRSC0002 (U101.76), CSC Connections Temp (P2.6 R47.2 S2.7)
EXT2: CRSC0002 (U101.74), CSC Connections Temp (P2.8 R48.2 S2.6)
EXT3: CRSC0002 (U101.73), CSC Connections Temp (P2.10 R49.2 S2.5)
EXT4: CRSC0002 (U101.72), CSC Connections Temp (P2.12)
EXT5: CRSC0002 (U101.70), CSC Connections Temp (P2.14)
EXT6: CRSC0002 (U101.69), CSC Connections Temp (P2.16)
EXT7: CRSC0002 (U101.68), CSC Connections Temp (P2.18)
EXT8: CRSC0002 (U101.67), CSC Connections Temp (P2.20)
EXT9: CRSC0002 (U101.66), CSC Connections Temp (P2.22)
FTDI.RXI: CRSC0002 (U101.202), CSC Connections Temp (D12.1 P3.2)
FTDI.TXO: CRSC0002 (U101.204), CSC Connections Temp (D1.1 P3.3)
I2C0.SCL: CRSC0002 (U101.48), CSC Connections Temp (P2.19 R5.1)
I2C0.SDA: CRSC0002 (U101.50), CSC Connections Temp (P2.21 R6.1)
I2C1.SCL: CRSC0002 (U101.96), CSC Connections Temp (P2.11 R3.1)
I2C1.SDA: CRSC0002 (U101.94), CSC Connections Temp (P2.13 R4.1)
I2C2.SCL: CRSC0002 (U101.100), CSC Connections Temp (P2.3 R1.1)
I2C2.SDA: CRSC0002 (U101.98), CSC Connections Temp (P2.5 R2.1)
JTAG.RTCK: CRSC0002 (R103.1 U101.206), CSC Connections Temp (P4.7)
JTAG.~{TRST}: CRSC0002 (U101.8), CSC Connections Temp (R51.1)
JTAG.TCK: CRSC0002 (R104.1 U101.10), CSC Connections Temp (D13.1 P4.4)
JTAG.TDI: CRSC0002 (U101.4), CSC Connections Temp (P4.8)
JTAG.TDO: CRSC0002 (U101.2), CSC Connections Temp (P4.6)
JTAG.TMS: CRSC0002 (U101.6), CSC Connections Temp (D2.1 P4.2)
LED0: CRSC0002 (U101.65), CSC Connections Temp (D10.1)
LED1: CRSC0002 (U101.64), CSC Connections Temp (D11.1)
LED2: CRSC0002 (U101.59), CSC Connections Temp (D3.1)
LED3: CRSC0002 (U101.58), CSC Connections Temp (D4.1)
LED4: CRSC0002 (U101.57), CSC Connections Temp (D5.1)
LED5: CRSC0002 (U101.56), CSC Connections Temp (D6.1)
LED6: CRSC0002 (U101.55), CSC Connections Temp (D7.1)
LED7: CRSC0002 (U101.54), CSC Connections Temp (D8.1)
NetS1_3: CRSC0002 (U101.110), CSC Connections Temp (S1.3)
~{RESET}: CRSC0002 (R102.1 U101.35), CSC Connections Temp (P4.10 R50.2 S3.5)